# EAGLE schematic reflip_sen_1.0 (EAGLE 8.7.0)
TITLE: LP-REFLIP-SEN-DK; VERSION: 1.0
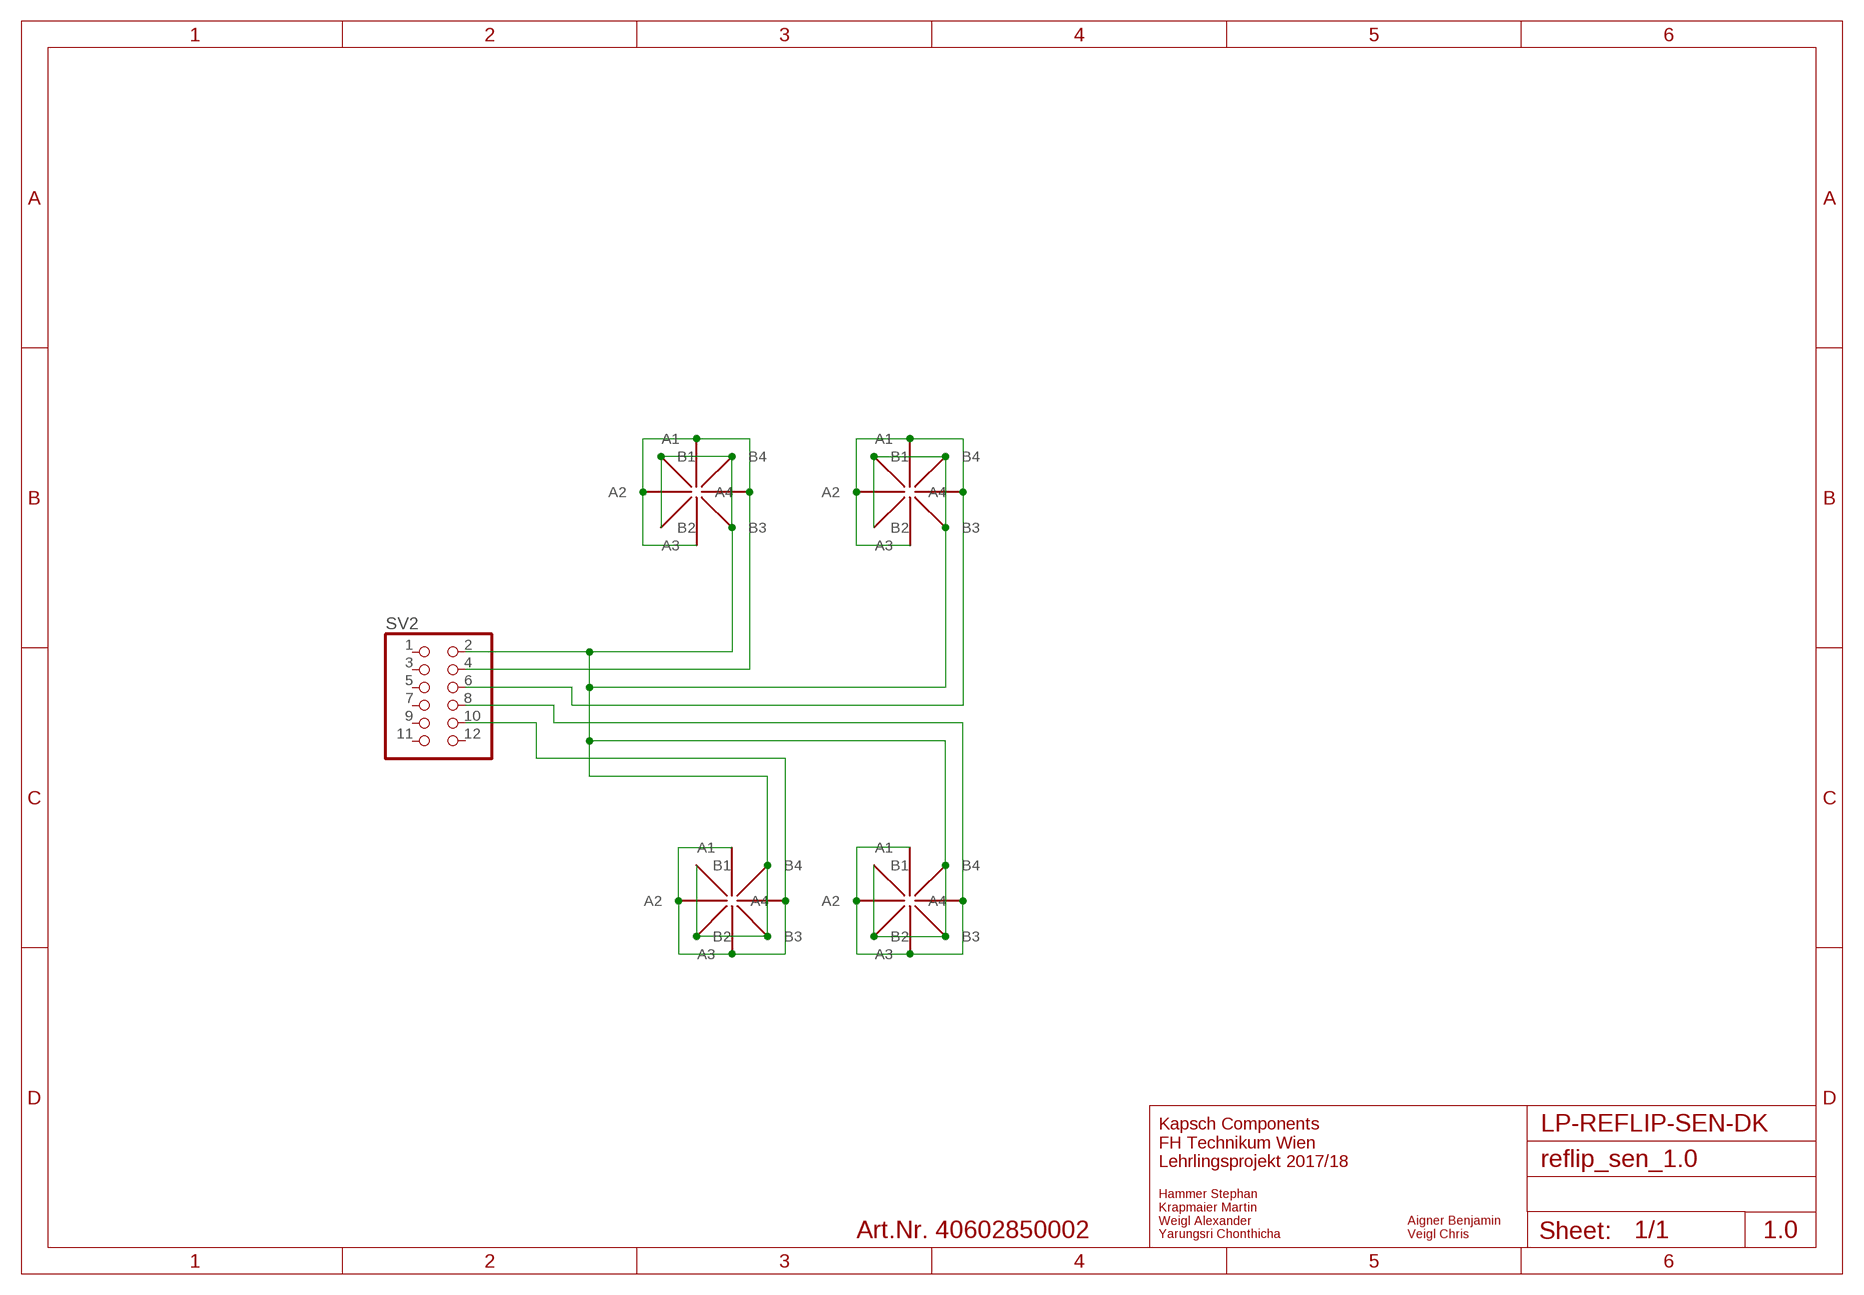
[diagram p0: schematic, sheet 1]

## Parts
SV2  PINHD-2X6_2.54-SMD  [2X06SMD]
U$1  KONTAKTFLAECHE  [KONTAKTFLAECHE]
U$2  KONTAKTFLAECHE  [KONTAKTFLAECHE]
U$3  KONTAKTFLAECHE  [KONTAKTFLAECHE]
U$4  KONTAKTFLAECHE  [KONTAKTFLAECHE]

## Nets
N$1: SV2.10 U$2.A1 U$2.A2 U$2.A3 U$2.A4
N$2: SV2.8 U$4.A1 U$4.A2 U$4.A3 U$4.A4
N$4: SV2.4 U$1.A1 U$1.A2 U$1.A3 U$1.A4
N$7: SV2.6 U$3.A1 U$3.A2 U$3.A3 U$3.A4
N$8: SV2.2 U$1.B1 U$1.B2 U$1.B3 U$1.B4 U$2.B1 U$2.B2 U$2.B3 U$2.B4 U$3.B1 U$3.B2 U$3.B3 U$3.B4 U$4.B1 U$4.B2 U$4.B3 U$4.B4
Unconnected: SV2.1 SV2.3 SV2.5 SV2.7 SV2.9 SV2.11 SV2.12

## Notes on the sheet
- Kapsch Components
  FH Technikum Wien
  Lehrlingsprojekt 2017/18
- Art.Nr. 40602850002
- Hammer Stephan
  Krapmaier Martin
  Weigl Alexander
  Yarungsri Chonthicha
- Aigner Benjamin
  Veigl Chris

## Library data of the parts
SV2 = 000_FlipMouse:PINHD-2X6: PIN HEADER
U$1-U$4 = 000_FlipMouse:KONTAKTFLAECHE